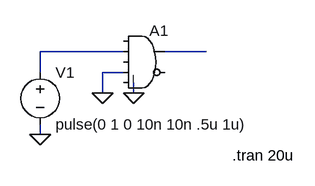
[diagram p0: schematic Gate2.asc]
Gate2.asc, the LTspice schematic file:
Version 4
SHEET 1 1220 680
WIRE 704 128 576 128
WIRE 832 128 768 128
WIRE 576 160 576 128
WIRE 704 160 672 160
WIRE 672 192 672 160
WIRE 720 192 720 176
WIRE 576 256 576 240
FLAG 576 256 0
FLAG 672 192 0
FLAG 720 192 0
SYMBOL voltage 576 144 R0
SYMATTR InstName V1
SYMATTR Value pulse(0 1 0 10n 10n .5u 1u)
SYMBOL digital\\and 736 80 R0
SYMATTR InstName A1
TEXT 872 288 Left 0 !.tran 20u

The netlist it stands for:
* Gate2.asc
V1 N001 0 pulse(0 1 0 10n 10n .5u 1u)
A1 0 N001 0 0 0 0 N002 0 AND
.tran 20u
.backanno
.end